# Altium schematic sheet Supply.SchDoc: =DocumentName
size A4; CompanyName: "AS Manufacturing" LLC; Organization: "AS Manufacturing" LLC; Address1: 5 Sklyarenka St.; Address2: Kyiv 04073; Address3: Ukraine; Address4: https://ajax.systems/en/; SheetNumber: 1; SheetTotal: 1; Template_version: 1.0.1
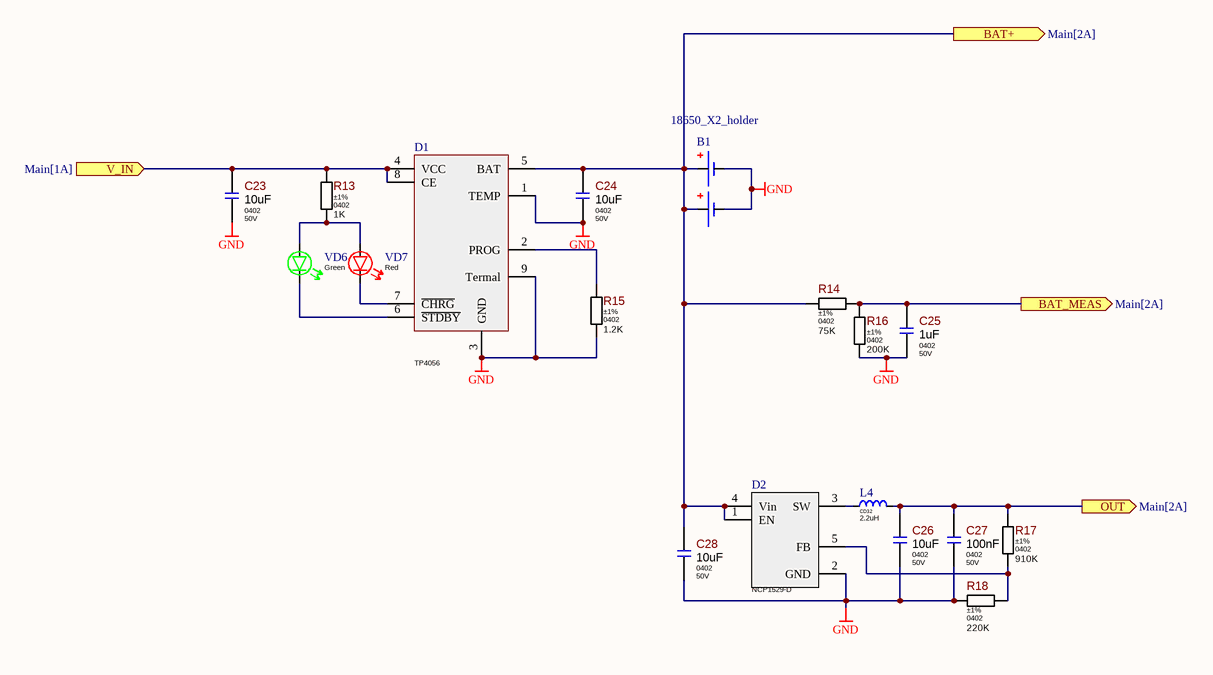
[diagram p0: Supply.SchDoc]

## Parts
B1  18650_X2_holder  [18650_X2]
C23  Package: 0402  Voltage: 50V  [Cap_0402]  (hidden comment: 10uF)
C24  Package: 0402  Voltage: 50V  [Cap_0402]  (hidden comment: 10uF)
C25  Package: 0402  Voltage: 50V  [Cap_0402]  (hidden comment: 1uF)
C26  Package: 0402  Voltage: 50V  [Cap_0402]  (hidden comment: 10uF)
C27  Package: 0402  Voltage: 50V  [Cap_0402]  (hidden comment: 100nF)
C28  Package: 0402  Voltage: 50V  [Cap_0402]  (hidden comment: 10uF)
D1  TP4056  [SOP-8-with thermal pad]
D2  NCP1529-D  [SOT-23-5]
L4  value 2.2uH  [CD32]  (hidden comment: CD32)
R13  value 1K  Tolerance: ±1%  Package: 0402  [Res_0402]  (hidden comment: Res_0402_1K)
R14  value 75K  Tolerance: ±1%  Package: 0402  [Res_0402]  (hidden comment: Res_0402_75K)
R15  value 1.2K  Tolerance: ±1%  Package: 0402  [Res_0402]  (hidden comment: Res_0402_1.2K)
R16  value 200K  Tolerance: ±1%  Package: 0402  [Res_0402]  (hidden comment: Res_0402_200K)
R17  value 910K  Tolerance: ±1%  Package: 0402  [Res_0402]  (hidden comment: Res_0402_910K)
R18  value 220K  Tolerance: ±1%  Package: 0402  [Res_0402]  (hidden comment: Res_0402_220K)
VD6  Color: Green  [0805_LED_GREEN]  (hidden comment: 0805_LED_GREEN)
VD7  Color: Red  [0805_LED_RED]  (hidden comment: 0805_LED_RED)

## Ports
BAT+ (out, see Main[2A]), BAT_MEAS (out, see Main[2A]), OUT (out, see Main[2A]), V_IN (in, see Main[1A])

## Nets
GND: B1.2(-) B1.4(-) C23.2 C24.2 C25.1 C26.2 C27.2 C28.2 D1.1(TEMP) D1.3(GND) D1.9(Termal) D2.2(GND) R15.2 R16.2 R18.2
BAT+: B1.1(+) B1.3(+) C24.1 C28.1 D1.5(BAT) D2.1(EN) D2.4(Vin) R14.1 ; port BAT+
BAT_MEAS: C25.2 R14.2 R16.1 ; port BAT_MEAS
OUT: C26.1 C27.1 L4.2 R17.1 ; port OUT
V_IN: C23.1 D1.4(VCC) D1.8(CE) R13.1 ; port V_IN
NetD1_2: D1.2(PROG) R15.1
NetD1_6: D1.6(~{STDBY}) VD6.2(C)
NetD1_7: D1.7(~{CHRG}) VD7.2(C)
NetD2_3: D2.3(SW) L4.1
NetD2_5: D2.5(FB) R17.2 R18.1
NetR13_2: R13.2 VD6.1(A) VD7.1(A)

## Notes on the sheet
- Title
- Product:
- Project:
- Size:
- Date:
- Variant:
- A4
- Authors:
- Time:
- Sheet
- of
- Rev:
- Commit:

## Library data of the parts
C23 C24 C26 C28 = Cap_0402_10uF: 10uF 50V  ±25% 0402 Ceramic Capacitor; Component Type: SMD; Tolerance: ±25%; ComponentLink1URL: https://search.murata.co.jp/Ceramy/image/img/A01X/G101/ENG/GRM31CR60J107ME39-01.pdf; ComponentLink1Description: Datasheet; Value: 10uF
C25 = Cap_0402_1uF: 1uF 50V  ±25% 0402 Ceramic Capacitor; Component Type: SMD; Tolerance: ±25%; ComponentLink1URL: https://search.murata.co.jp/Ceramy/image/img/A01X/G101/ENG/GRM31CR60J107ME39-01.pdf; ComponentLink1Description: Datasheet; Value: 1uF
C27 = Cap_0402_100nF: 100nF 50V  ±25% 0402 Ceramic Capacitor; Component Type: SMD; Tolerance: ±25%; ComponentLink1URL: https://search.murata.co.jp/Ceramy/image/img/A01X/G101/ENG/GRM31CR60J107ME39-01.pdf; ComponentLink1Description: Datasheet; Value: 100nF
D1 = TP4056: Lion Charger 1A; Name: TP4056
D2 = NCP1529-D: In 2.7-5.5v 1A 1.7MHz DC-DC; Name: NCP1529-D
L4 = CD32: 2.2uH; Size: CD32
R13 = Res_0402_1K: ±1% 1/16W 0402; Power Rating: 0.062W; Voltage: 50V; ComponentLink1URL: https://www.yageo.com/upload/media/product/productsearch/datasheet/rchip/PYu-RC_Group_51_RoHS_L_10.pdf; ComponentLink1Description: Datasheet
R14 = Res_0402_75K: ±1% 1/16W 0402; Power Rating: 0.062W; Voltage: 50V; ComponentLink1URL: https://www.yageo.com/upload/media/product/productsearch/datasheet/rchip/PYu-RC_Group_51_RoHS_L_10.pdf; ComponentLink1Description: Datasheet
R15 = Res_0402_1.2K: ±1% 1/16W 0402; Power Rating: 0.062W; Voltage: 50V; ComponentLink1URL: https://www.yageo.com/upload/media/product/productsearch/datasheet/rchip/PYu-RC_Group_51_RoHS_L_10.pdf; ComponentLink1Description: Datasheet
R16 = Res_0402_200K: ±1% 1/16W 0402; Power Rating: 0.062W; Voltage: 50V; ComponentLink1URL: https://www.yageo.com/upload/media/product/productsearch/datasheet/rchip/PYu-RC_Group_51_RoHS_L_10.pdf; ComponentLink1Description: Datasheet
R17 = Res_0402_910K: ±1% 1/16W 0402; Power Rating: 0.062W; Voltage: 50V; ComponentLink1URL: https://www.yageo.com/upload/media/product/productsearch/datasheet/rchip/PYu-RC_Group_51_RoHS_L_10.pdf; ComponentLink1Description: Datasheet
R18 = Res_0402_220K: ±1% 1/16W 0402; Power Rating: 0.062W; Voltage: 50V; ComponentLink1URL: https://www.yageo.com/upload/media/product/productsearch/datasheet/rchip/PYu-RC_Group_51_RoHS_L_10.pdf; ComponentLink1Description: Datasheet
VD6 = 0805_LED_GREEN: V=3v - 3.2v / I=20mA
VD7 = 0805_LED_RED: V=2v - 2.2v / I=20mA